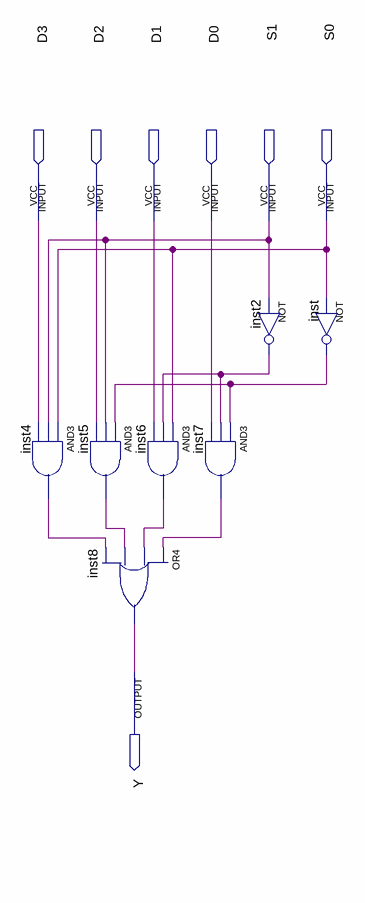
[diagram p0: schematic sheet]
// Quartus schematic Bit4Sel.bdf as structural Verilog: 7 symbols, 7 pins
module Bit4Sel (
  input  D3,
  input  D2,
  input  D1,
  input  D0,
  input  S1,
  input  S0,
  output Y
);

  wire inst2_out, inst4_out, inst5_out, inst6_out, inst7_out, inst_out;

  and inst4 (inst4_out, S0, S1, D3);
  and inst5 (inst5_out, inst_out, S1, D2);
  or inst8 (Y, inst7_out, inst6_out, inst5_out, inst4_out);
  and inst6 (inst6_out, S0, inst2_out, D1);
  not inst2 (inst2_out, S1);
  and inst7 (inst7_out, inst_out, inst2_out, D0);
  not inst (inst_out, S0);
endmodule
